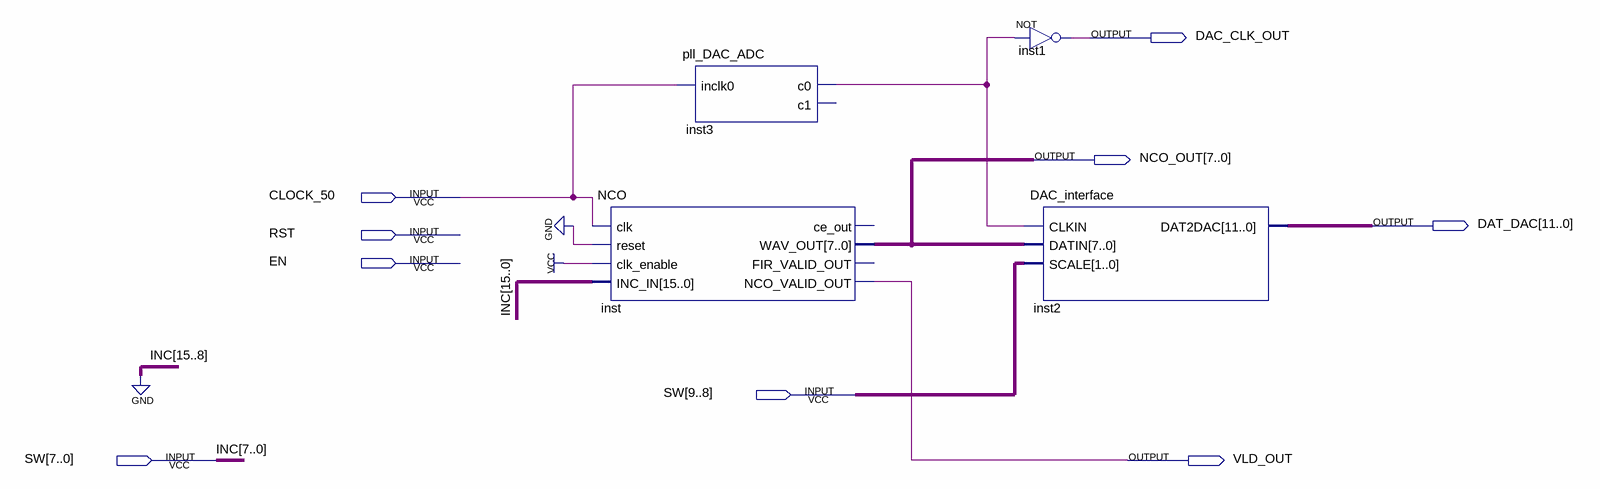
[diagram p0: schematic sheet]
// Quartus schematic NCO_quartus.bdf as structural Verilog: 4 symbols, 9 pins
module NCO_quartus (
  input  CLOCK_50,
  input  RST,
  input  EN,
  input  [9:0] SW,
  output DAC_CLK_OUT,
  output [7:0] NCO_OUT,
  output [11:0] DAT_DAC,
  output VLD_OUT
);

  wire inst3_c0;

  NCO inst (
    .clk(CLOCK_50), .reset(1'b0), .clk_enable(1'b1), .INC_IN({{8{1'b0}}, SW[7:0]}), .WAV_OUT(NCO_OUT),
    .NCO_VALID_OUT(VLD_OUT));  // open: ce_out, FIR_VALID_OUT
  pll_DAC_ADC inst3 (.inclk0(CLOCK_50), .c0(inst3_c0));  // open: c1
  not inst1 (DAC_CLK_OUT, inst3_c0);
  DAC_interface inst2 (.CLKIN(inst3_c0), .DATIN(NCO_OUT), .SCALE(SW[9:8]), .DAT2DAC(DAT_DAC));

  // Other names for the same wires on the sheet: INC[7:0] = SW[7:0]
endmodule
